# EAGLE design board (EAGLE 6.5.0)
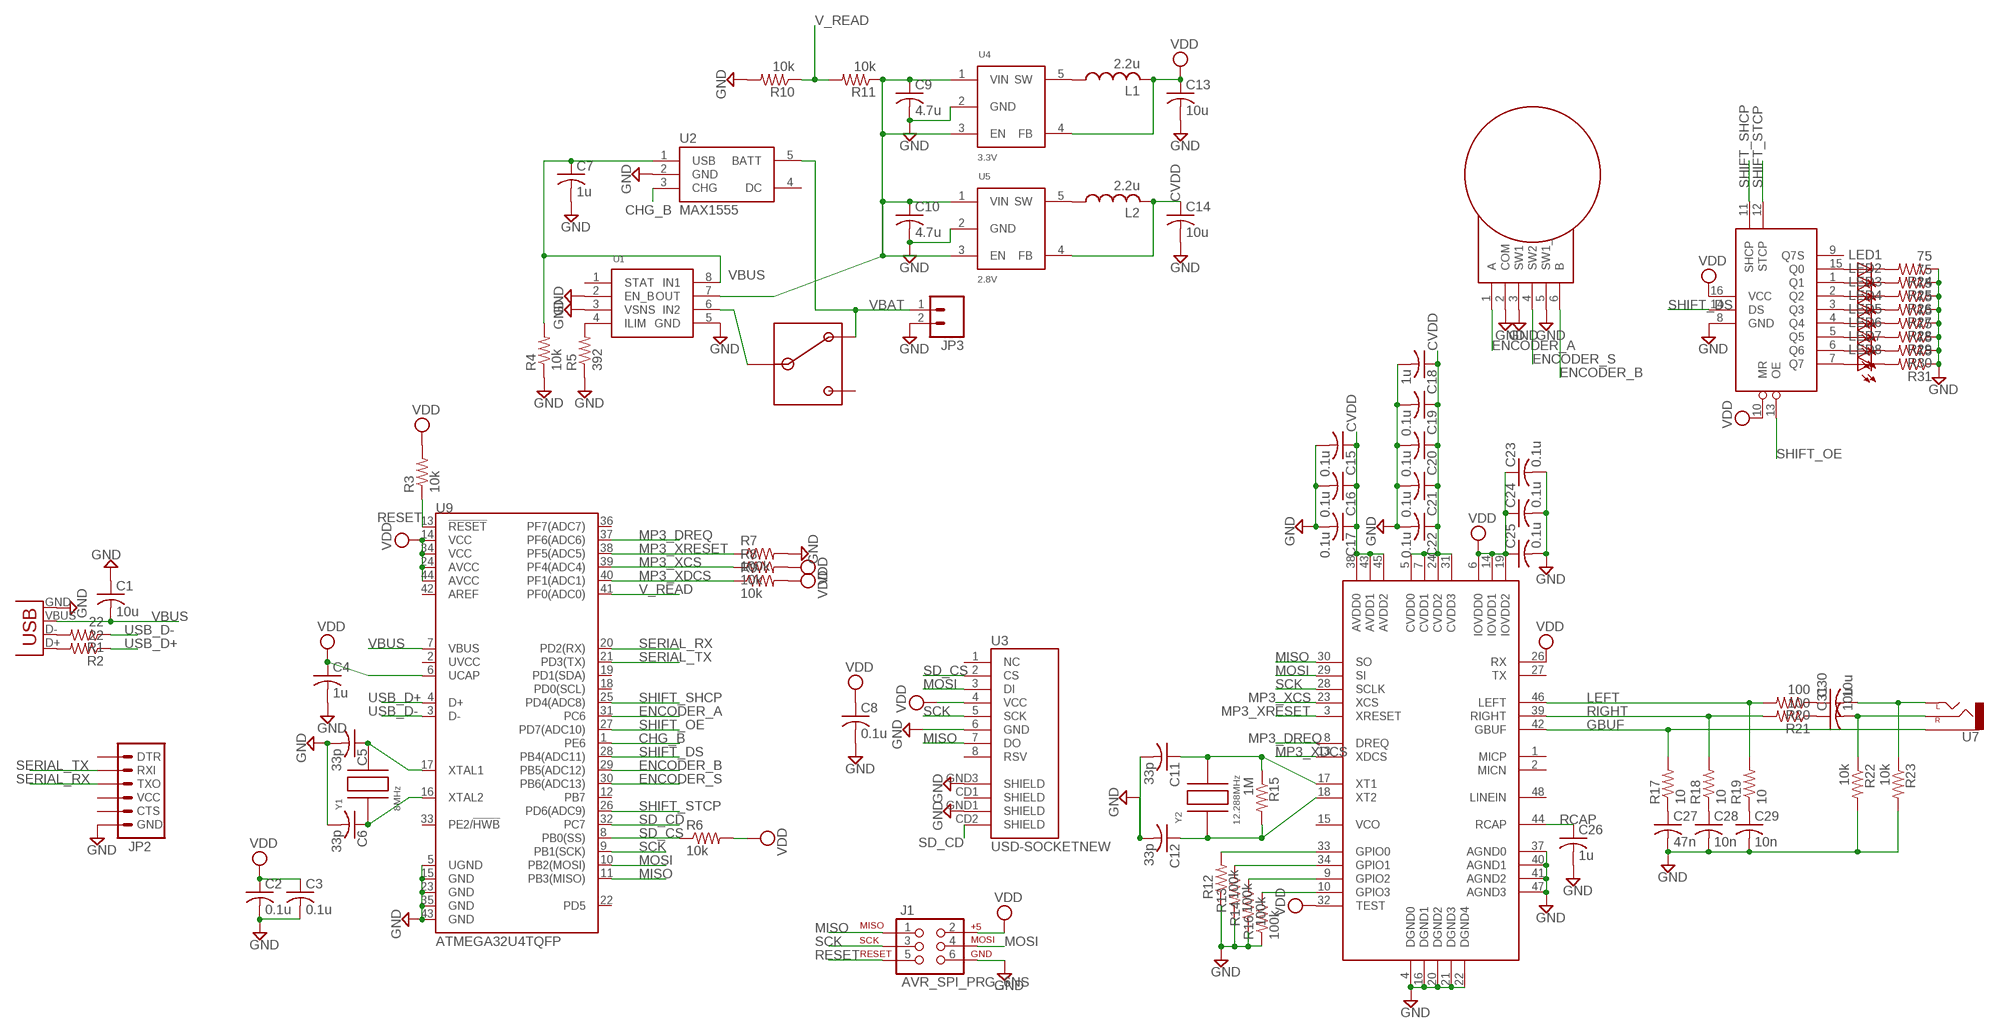
[diagram p0: schematic, sheet 1]

## Parts
C1  10u  C-USC0603K  [C0603K]
C2  0.1u  C-USC0603K  [C0603K]
C3  0.1u  C-USC0603K  [C0603K]
C4  1u  C-USC0603K  [C0603K]
C5  33p  C-USC0603K  [C0603K]
C6  33p  C-USC0603K  [C0603K]
C7  1u  C-USC0603K  [C0603K]
C8  0.1u  C-USC0603K  [C0603K]
C9  4.7u  C-USC0603K  [C0603K]
C10  4.7u  C-USC0603K  [C0603K]
C11  33p  C-USC0603K  [C0603K]
C12  33p  C-USC0603K  [C0603K]
C13  10u  C-USC0603K  [C0603K]
C14  10u  C-USC0603K  [C0603K]
C15  0.1u  C-USC0603K  [C0603K]
C16  0.1u  C-USC0603K  [C0603K]
C17  0.1u  C-USC0603K  [C0603K]
C18  1u  C-USC0603K  [C0603K]
C19  0.1u  C-USC0603K  [C0603K]
C20  0.1u  C-USC0603K  [C0603K]
C21  0.1u  C-USC0603K  [C0603K]
C22  0.1u  C-USC0603K  [C0603K]
C23  0.1u  C-USC0603K  [C0603K]
C24  0.1u  C-USC0603K  [C0603K]
C25  0.1u  C-USC0603K  [C0603K]
C26  1u  C-USC0603K  [C0603K]
C27  47n  C-USC0603K  [C0603K]
C28  10n  C-USC0603K  [C0603K]
C29  10n  C-USC0603K  [C0603K]
C30  10u  C-USC0603K  [C0603K]
C31  10u  C-USC0603K  [C0603K]
J1  AVR_SPI_PRG_6NS  [2X3-NS]
JP1  USBSMD  [USB-MINIB]
JP2  ARDUINO_SERIAL_PROGRAMLOCK  [1X06_LOCK]
JP3  M02PTH  [1X02]
L1  2.2u  IHLP-2020CZ-11  [IHLP-2020CZ-11]
L2  2.2u  IHLP-2020CZ-11  [IHLP-2020CZ-11]
LED1  LED1206  [LED-1206]
LED2  LED1206  [LED-1206]
LED3  LED1206  [LED-1206]
LED4  LED1206  [LED-1206]
LED5  LED1206  [LED-1206]
LED6  LED1206  [LED-1206]
LED7  LED1206  [LED-1206]
LED8  LED1206  [LED-1206]
R1  22  R-US_R0603W  [R0603W]
R2  22  R-US_R0603W  [R0603W]
R3  10k  R-US_R0603  [R0603]
R4  10k  R-US_R0603  [R0603]
R5  392  R-US_R0603  [R0603]
R6  10k  R-US_R0603W  [R0603W]
R7  100k  R-US_R0603W  [R0603W]
R8  10k  R-US_R0603W  [R0603W]
R9  10k  R-US_R0603W  [R0603W]
R10  10k  R-US_R0603  [R0603]
R11  10k  R-US_R0603  [R0603]
R12  100k  R-US_R0603W  [R0603W]
R13  100k  R-US_R0603W  [R0603W]
R14  100k  R-US_R0603W  [R0603W]
R15  1M  R-US_R0603  [R0603]
R16  100k  R-US_R0603W  [R0603W]
R17  10  R-US_R0603W  [R0603W]
R18  10  R-US_R0603W  [R0603W]
R19  10  R-US_R0603W  [R0603W]
R20  100  R-US_R0603W  [R0603W]
R21  100  R-US_R0603W  [R0603W]
R22  10k  R-US_R0603W  [R0603W]
R23  10k  R-US_R0603W  [R0603W]
R24  75  R-US_R0603W  [R0603W]
R25  75  R-US_R0603W  [R0603W]
R26  75  R-US_R0603W  [R0603W]
R27  75  R-US_R0603W  [R0603W]
R28  75  R-US_R0603W  [R0603W]
R29  75  R-US_R0603W  [R0603W]
R30  75  R-US_R0603W  [R0603W]
R31  75  R-US_R0603W  [R0603W]
S1  JS102011SAQN  [JS102011SAQN]
S2  EVQ-WKA  [EVQ-WKA]
U1  TPS2112A  [TSSOP8]
U2  MAX1555  [SOT23-5]
U3  USD-SOCKETNEW  [MICRO-SD-SOCKET-PP]
U4  3.3V  LM3671  [SOT23-5]
U5  2.8V  LM3671  [SOT23-5]
U6  74HC595  [TSSOP16]
U7  AUDIO-JACKSMD2  [AUDIO-JACK-3.5MM-SMD]
U8  VS1003  [LQFP-48]
U9  ATMEGA32U4TQFP  [SPARKFUN-DIGITALIC_TQFP44]
Y1  8MHz  CSM-7X  [HC49/US]
Y2  12.288MHz  CSM-3X  [CSM-3X]

## Nets
CHG_B: U2.3(CHG) U9.1(PE6)
CVDD: C14.1 C15.1 C16.1 C17.1 C18.1 C19.1 C20.1 C21.1 C22.1 L2.P$2 U5.4(FB) U8.5(CVDD0) U8.7(CVDD1) U8.24(CVDD2) U8.31(CVDD3) U8.38(AVDD0) U8.43(AVDD1) U8.45(AVDD2)
ENCODER_A: S2.1(A) U9.31(PC6)
ENCODER_B: S2.6(B) U9.29(PB5(ADC12))
ENCODER_S: S2.4(SW2) U9.30(PB6(ADC13))
GBUF: R17.2 U7.SLEEVE U8.42(GBUF)
GND: C1.1 C2.2 C3.2 C4.2 C5.2 C6.2 C7.2 C8.2 C9.2 C10.2 C11.2 C12.2 C13.2 C14.2 C15.2 C16.2 C17.2 C18.2 C19.2 C20.2 C21.2 C22.2 C23.2 C24.2 C25.2 C26.2 C27.2 C28.2 C29.2 J1.6 JP1.GND JP2.6(GND) JP3.2 R4.1 R5.1 R7.2 R10.2 R12.1 R13.1 R14.1 R16.1 R22.2 R23.2 R24.1 R25.1 R26.1 R27.1 R28.1 R29.1 R30.1 R31.1 S2.2(COM) S2.3(SW1) S2.5(SW1_) U1.2(EN_B) U1.3(VSNS) U1.5(GND) U2.2(GND) U3.6(GND) U3.GND1(SHIELD) U3.GND3(SHIELD) U4.2(GND) U5.2(GND) U6.8(GND) U8.4(DGND0) U8.16(DGND1) U8.20(DGND2) U8.21(DGND3) U8.22(DGND4) U8.37(AGND0) U8.40(AGND1) U8.41(AGND2) U8.47(AGND3) U9.5(UGND) U9.15(GND) U9.23(GND) U9.35(GND) U9.43(GND)
GPIO0: R12.2 U8.33(GPIO0)
GPIO1: R13.2 U8.34(GPIO1)
GPIO2: R14.2 U8.9(GPIO2)
GPIO3: R16.2 U8.10(GPIO3)
LEFT: R19.2 R20.2 U8.46(LEFT)
MISO: J1.1 U3.7(DO) U8.30(SO) U9.11(PB3(MISO))
MOSI: J1.4 U3.3(DI) U8.29(SI) U9.10(PB2(MOSI))
MP3_DREQ: U8.8(DREQ) U9.37(PF6(ADC6))
MP3_XCS: R8.1 U8.23(XCS) U9.39(PF4(ADC4))
MP3_XDCS: R9.1 U8.13(XDCS) U9.40(PF1(ADC1))
MP3_XRESET: R7.1 U8.3(XRESET) U9.38(PF5(ADC5))
N$1: JP1.D- R1.2
N$2: C5.1 U9.17(XTAL1) Y1.P$2
N$3: C27.1 R17.1
N$4: C28.1 R18.1
N$5: C29.1 R19.1
N$6: JP1.D+ R2.2
N$7: C12.1 R15.2 U8.18(XT2) Y2.P$1
N$8: C11.1 R15.1 U8.17(XT1) Y2.P$2
N$10: C31.1 R21.1
N$11: C30.1 R20.1
N$12: C31.2 R22.1 U7.RING(RIGHT)
N$13: C30.2 R23.1 U7.TIP(LEFT)
N$14: C6.1 U9.16(XTAL2) Y1.P$1
N$17: R5.2 U1.4(ILIM)
N$18: C9.1 C10.1 R11.1 U1.7(OUT) U4.1(VIN) U4.3(EN) U5.1(VIN) U5.3(EN)
N$19: LED8.A U6.7(Q7)
N$20: LED7.A U6.6(Q6)
N$21: LED6.A U6.5(Q5)
N$22: LED5.A U6.4(Q4)
N$23: LED4.A U6.3(Q3)
N$24: LED3.A U6.2(Q2)
N$25: LED2.A U6.1(Q1)
N$26: LED1.A U6.15(Q0)
N$27: LED1.C R24.2
N$28: LED2.C R25.2
N$29: LED3.C R26.2
N$30: LED4.C R27.2
N$31: LED5.C R28.2
N$32: LED6.C R29.2
N$33: LED7.C R30.2
N$34: LED8.C R31.2
N$35: L1.P$1 U4.5(SW)
N$36: L2.P$1 U5.5(SW)
N$37: S1.P$2 U1.6(IN2)
RCAP: C26.1 U8.44(RCAP)
RESET: J1.5 R3.1 U9.13(!RESET)
RIGHT: R18.2 R21.2 U8.39(RIGHT)
SCK: J1.3 U3.5(SCK) U8.28(SCLK) U9.9(PB1(SCK))
SD_CD: U3.CD2(SHIELD) U9.32(PC7)
SD_CS: R6.1 U3.2(CS) U9.8(PB0(SS))
SERIAL_RX: JP2.3(TXO) U9.20(PD2(RX))
SERIAL_TX: JP2.2(RXI) U9.21(PD3(TX))
SHIFT_DS: U6.14(DS) U9.28(PB4(ADC11))
SHIFT_OE: U6.13(OE) U9.27(PD7(ADC10))
SHIFT_SHCP: U6.11(SHCP) U9.25(PD4(ADC8))
SHIFT_STCP: U6.12(STCP) U9.26(PD6(ADC9))
USB_D+: R2.1 U9.4(D+)
USB_D-: R1.1 U9.3(D-)
V_READ: R10.1 R11.2 U9.41(PF0(ADC0))
VBAT: JP3.1 S1.P$3 U2.5(BATT)
VBUS: C1.2 C7.1 JP1.VBUS R4.2 U1.8(IN1) U2.1(USB) U9.7(VBUS)
VDD: C2.1 C3.1 C4.1 C8.1 C13.1 C23.1 C24.1 C25.1 J1.2 L1.P$2 R3.2 R6.2 R8.2 R9.2 U3.4(VCC) U4.4(FB) U6.10(MR) U6.16(VCC) U8.6(IOVDD0) U8.14(IOVDD1) U8.19(IOVDD2) U8.26(RX) U8.32(TEST) U9.6(UCAP) U9.14(VCC) U9.24(AVCC) U9.34(VCC) U9.44(AVCC)
Unconnected: JP2.1(DTR) JP2.4(VCC) JP2.5(CTS) S1.P$1 U1.1(STAT) U2.4(DC) U3.1(NC) U3.8(RSV) U3.CD1(SHIELD) U6.9(Q7S) U8.1(MICP) U8.2(MICN) U8.15(VCO) U8.27(TX) U8.48(LINEIN) U9.2(UVCC) U9.12(PB7) U9.18(PD0(SCL)) U9.19(PD1(SDA)) U9.22(PD5) U9.33(PE2/!HWB) U9.36(PF7(ADC7)) U9.42(AREF)

## Library data of the parts
C1-C31 = rcl:C-US: CAPACITOR, American symbol
J1 = SparkFun-Connectors:AVR_SPI_PRG_6: AVR ISP 6 Pin This is the reduced ISP connector for AVR programming. Common on Arduino. This footprint will take up less PCB space and can be used with a 10-pin to 6-pin adapter such as SKU: BOB-08508
JP1 = SparkFun-Connectors:USB: USB Connectors USB-B-PTH is fully proven SKU : PRT-00139/CONN-08278 USB-miniB is fully proven SKU : PRT-00587 USB-A-PCB is untested. USB-A-H is throughly reviewed, but untested. Spark Fun Electronics SKU : PRT-00437 USB-B-SMT is throughly reviewed, but untested. Needs silkscreen touching up. USB-A-S has not been used/tested USB-MB-H has not been used/tested USB-MICROB has been used. CONN-09505
JP2 = SparkFun-Connectors:ARDUINO_SERIAL_PROGRAM: FTDI connector footprints
JP3 = SparkFun-Connectors:M02: Header 2 Standard 2-pin 0.1" header. Use with straight break away headers (SKU : PRT-00116), right angle break away headers (PRT-00553), swiss pins (PRT-00743), machine pins (PRT-00117), and female headers (PRT-00115). Molex polarized connector foot print use with SKU : PRT-08233 with associated crimp pins and housings.
L1 L2 = mkmp3:IHLP-2020CZ-11: IHLP-2020CZ-11 - SMT Inductor Digikey: 541-1236-1-ND
LED1-LED8 = LilyPad-Wearables:LED: LEDs Standard schematic elements and footprints for 5mm, 3mm, 1206, and 0603 sized LEDs. 5mm - Spark Fun Electronics SKU : Comp-SBL
R1-R31 = rcl:R-US_: RESISTOR, American symbol
S1 = mkmp3:JS102011SAQN: JS102011SAQN - SMT slide switch Digikey: 401-1999-1-ND
S2 = mkmp3:EVQ-WKA: EVQ-WKA - Rotary encoder & switch Digikey: P13381SCT-ND
U1 = mkmp3:TPS2112A: TPS2112A - Source selector switch Digikey: 296-34595-5-ND
U2 = SparkFun-PowerIC:MAX1555: MAX1555 Lithium Charger IC SOT-23 Lithium Polymer charging IC. Schematic element and footprint proven. Spark Fun Electronics SKU : COM-00674
U3 = SparkFun-Connectors:USD-SOCKET: microSD Socket Push-push type uSD socket. Schematic element and footprint production proven. Spark Fun Electronics SKU : PRT-00127. tDoc lines correctly indicate media card edge positions when inserting (unlocked, locked, depressed).
U4 U5 = mkmp3:LM3671: LM3671 - Buck regulator Texas Instruments Step-down (buck) power regulator
U6 = mkmp3:74HC595: 74HC595 - 8-bit shift register Digikey: 568-2263-1-ND
U7 = mkmp3:AUDIO-JACK: 3.5mm Audio Jack Simple 3.5mm common PCB mount audio jack. SKU: PRT-08032
U8 = mkmp3:VS1003
U9 = SparkFun-DigitalIC:ATMEGA32U4: Atmel 44-pin 8-bit Microcontroller with 32KBytes of ISP Flash and USB Controller ----- Please use the QFN-44-NOPAD_1:1 package for the footprint of all boards using a 32U4. Route traces directly away from the pads as much as possible.
Y1 = mkmp3:CSM-7X: CSM-7X - Quartz Crystal ECS International SMD version of the HC-49USX leaded crystal
Y2 = mkmp3:CSM-3X: CMS-3X - Quartz Crystal ECS International Miniature low profile SMD quartz crystal

## Board
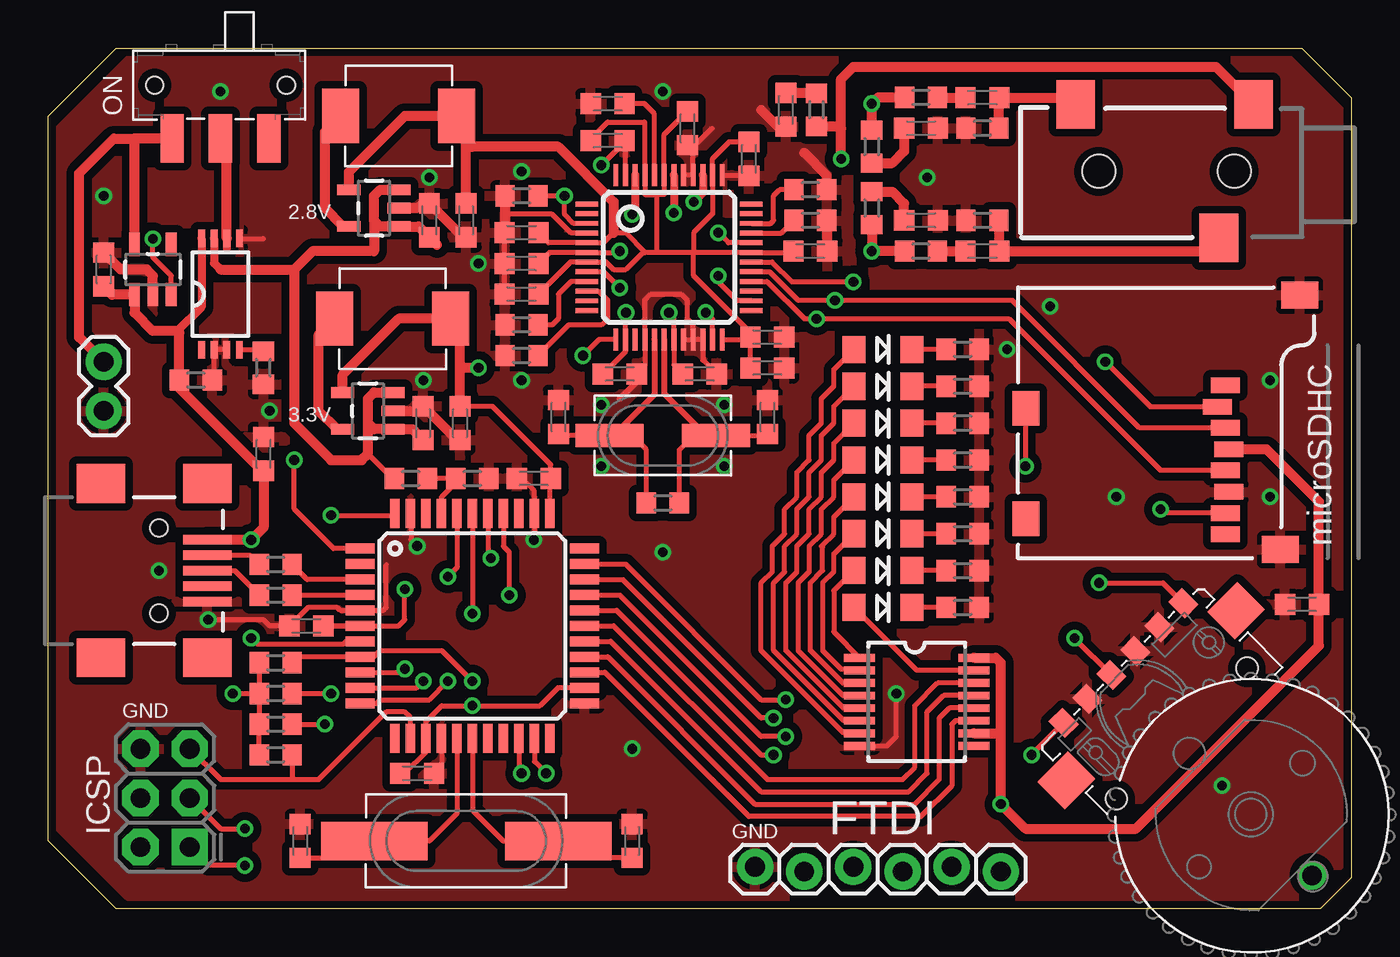
[diagram p1: board, top side]
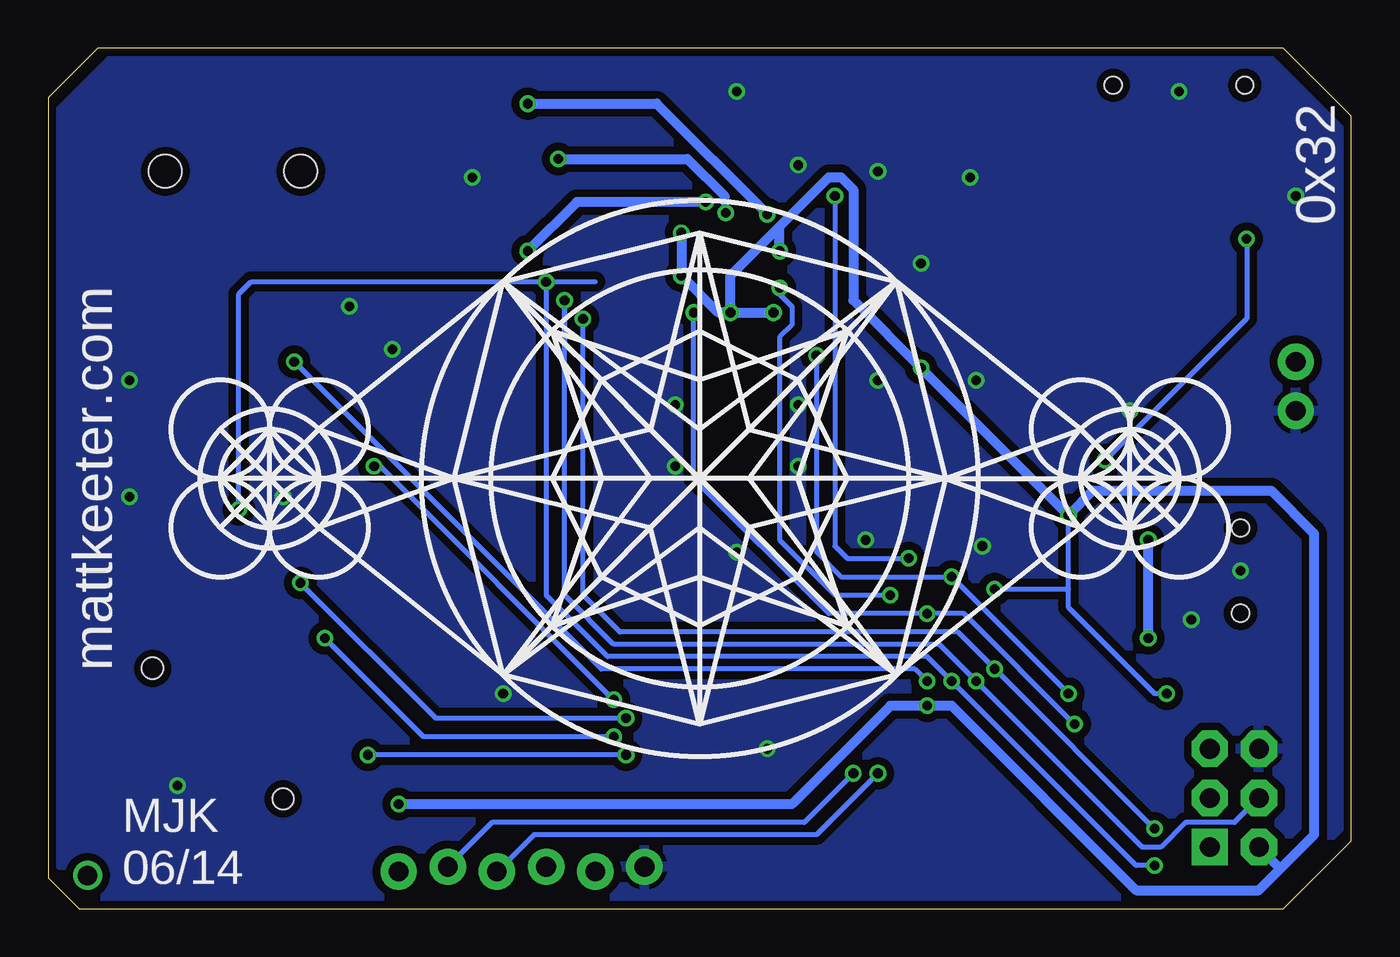
[diagram p2: board, bottom side, seen from below]

Size 67.31 x 44.45 mm. Coordinates in mm from the lower left corner, seen from the top.
Outline: 0,3.49 0,40.96 3.49,44.45 64.77,44.45 67.31,41.91 67.31,1.59 65.72,0 3.49,0 0,3.49
Copper layers (1*16): Top 0.0356mm / dielectric 1.5011mm / Bottom 0.0356mm
Design rules "OSHpark *": minimum track width 6mil, minimum drill 13mil, track to track 6mil, track to pad 6mil, pad to pad 6mil, via to via 6mil, smd to smd 6mil, copper to edge 15mil, drill to drill 6mil, minimum pad ring 7mil, minimum via ring 7mil, stop-mask expansion 4mil, vias tented up to drill 20mil, thermal gap 10mil

### Footprints (pad centres in the part's own frame; a part is rotated, then mirrored left to right if it is on the bottom)
C0603K = smd 1.05 x 1.08: 1 -0.875,0; 2 0.875,0
2X3-NS = drill 1.016 pad 1.88 square: 1 -2.54,-1.27 | drill 1.016 pad 1.88 octagon: 2 -2.54,1.27; 3 0,-1.27; 4 0,1.27; 5 2.54,-1.27; 6 2.54,1.27
USB-MINIB = smd 2.5 x 0.5: D+ 2.5,0; D- 2.5,0.8; GND 2.5,-1.6; ID 2.5,-0.8; VBUS 2.5,1.6 | smd 2.5 x 2: MTN1 -3,4.5; MTN2 2.5,4.5; MTN3 -3,-4.5; MTN4 2.5,-4.5 | hole 0.9: 0,2.2; 0,-2.2
1X06_LOCK = drill 1.016 pad 1.88: 1 0,0; 2 2.54,-0.254; 3 5.08,0; 4 7.62,-0.254; 5 10.16,0; 6 12.7,-0.254
1X02 = drill 1.016 pad 1.88: 1 0,0; 2 2.54,0
IHLP-2020CZ-11 = smd 1.905 x 2.794: P$1 -2.997,0; P$2 2.997,0
LED-1206 = smd 1.2 x 1.4: A -1.5,0; C 1.5,0
R0603W = smd 1 x 1.1: 1 -0.85,0; 2 0.85,0
R0603 = smd 1 x 1.1: 1 -0.85,0; 2 0.85,0
JS102011SAQN = smd 1.2 x 2.5: P$1 -2.5,2.75; P$2 0,2.75; P$3 2.5,2.75 | hole 0.9: -3.4,0; 3.4,0
EVQ-WKA = smd 1 x 1.2: 1 -5.25,0; 2 -3.5,0; 3 -1.75,0; 4 0,0; 5 1.75,0; 6 3.5,0 | smd 2.2 x 2: NC1 -6.9,2.2; NC2 5.5,2.2 | drill 1: P$1 0,14.65 | hole 1.1: 4.35,4.7; -5.2,4.7
TSSOP8 = smd 0.9 x 0.35: 1 -2.875,0.975; 2 -2.875,0.325; 3 -2.875,-0.325; 4 -2.875,-0.975; 5 2.875,-0.975; 6 2.875,-0.325; 7 2.875,0.325; 8 2.875,0.975
SOT23-5 = smd 0.55 x 1.2: 1 -0.95,-1.3; 2 0,-1.3; 3 0.95,-1.3; 4 0.95,1.3; 5 -0.95,1.3
MICRO-SD-SOCKET-PP = smd 0.8 x 1.5: 1 -8.94,10.7; 2 -7.84,10.3; 3 -6.74,10.7; 4 -5.64,10.9; 5 -4.54,10.7; 6 -3.44,10.9; 7 -2.34,10.7; 8 -1.24,10.7 | smd 1.8 x 1.4: CD1 -2.05,0.4; CD2 -7.75,0.4 | smd 1.4 x 1.9: GND1 -13.6,14.55; GND3 -0.45,13.55
TSSOP16 = smd 0.4 x 1.6: 1 -2.225,-2.85; 2 -1.575,-2.85; 3 -0.925,-2.85; 4 -0.275,-2.85; 5 0.375,-2.85; 6 1.025,-2.85; 7 1.675,-2.85; 8 2.325,-2.85; 9 2.325,3.05; 10 1.675,3.05; 11 1.025,3.05; 12 0.375,3.05; 13 -0.275,3.05; 14 -0.925,3.05; 15 -1.575,3.05; 16 -2.225,3.05
AUDIO-JACK-3.5MM-SMD = smd 2 x 2.5: RING 4.3,3.45; SLEEVE 2.5,-3.45; TIP 11.7,-3.45 | hole 1.702: 3.5,0; 10.5,0
LQFP-48 = smd 0.254 x 1.143: 1 -2.75,-4.25; 2 -2.25,-4.25; 3 -1.75,-4.25; 4 -1.25,-4.25; 5 -0.75,-4.25; 6 -0.25,-4.25; 7 0.25,-4.25; 8 0.75,-4.25; 9 1.25,-4.25; 10 1.75,-4.25; 11 2.25,-4.25; 12 2.75,-4.25; 25 2.75,4.25; 26 2.25,4.25; 27 1.75,4.25; 28 1.25,4.25; 29 0.75,4.25; 30 0.25,4.25; 31 -0.25,4.25; 32 -0.75,4.25; 33 -1.25,4.25; 34 -1.75,4.25; 35 -2.25,4.25; 36 -2.75,4.25 | smd 1.143 x 0.254: 13 4.25,-2.75; 14 4.25,-2.25; 15 4.25,-1.75; 16 4.25,-1.25; 17 4.25,-0.75; 18 4.25,-0.25; 19 4.25,0.25; 20 4.25,0.75; 21 4.25,1.25; 22 4.25,1.75; 23 4.25,2.25; 24 4.25,2.75; 37 -4.25,2.75; 38 -4.25,2.25; 39 -4.25,1.75; 40 -4.25,1.25; 41 -4.25,0.75; 42 -4.25,0.25; 43 -4.25,-0.25; 44 -4.25,-0.75; 45 -4.25,-1.25; 46 -4.25,-1.75; 47 -4.25,-2.25; 48 -4.25,-2.75
SPARKFUN-DIGITALIC_TQFP44 = smd 1.5 x 0.5: 1 -5.8,4; 2 -5.8,3.2; 3 -5.8,2.4; 4 -5.8,1.6; 5 -5.8,0.8; 6 -5.8,0; 7 -5.8,-0.8; 8 -5.8,-1.6; 9 -5.8,-2.4; 10 -5.8,-3.2; 11 -5.8,-4; 23 5.8,-4; 24 5.8,-3.2; 25 5.8,-2.4; 26 5.8,-1.6; 27 5.8,-0.8; 28 5.8,0; 29 5.8,0.8; 30 5.8,1.6; 31 5.8,2.4; 32 5.8,3.2; 33 5.8,4 | smd 0.5 x 1.5: 12 -4,-5.8; 13 -3.2,-5.8; 14 -2.4,-5.8; 15 -1.6,-5.8; 16 -0.8,-5.8; 17 0,-5.8; 18 0.8,-5.8; 19 1.6,-5.8; 20 2.4,-5.8; 21 3.2,-5.8; 22 4,-5.8; 34 4,5.8; 35 3.2,5.8; 36 2.4,5.8; 37 1.6,5.8; 38 0.8,5.8; 39 0,5.8; 40 -0.8,5.8; 41 -1.6,5.8; 42 -2.4,5.8; 43 -3.2,5.8; 44 -4,5.8
HC49/US = smd 5.5 x 2: P$1 -4.75,0; P$2 4.75,0
CSM-3X = smd 3.5 x 1.2: P$1 -2.75,0; P$2 2.75,0

### Placement (x,y rotation side)
C1  11.11,23.5 270 top
C2  25.08,22.23 180 top
C3  19.05,6.98 0 top
C4  13.33,14.61 180 top
C5  30.16,3.49 90 top
C6  13.02,3.49 90 top
C7  2.86,33.02 90 top
C8  64.77,15.72 180 top
C9  19.37,25.08 90 top
C10  19.69,35.56 90 top
C11  26.35,25.4 90 top
C12  37.15,25.4 90 top
C13  21.27,25.08 270 top
C14  21.59,35.56 270 top
C15  36.2,38.73 270 top
C16  33.02,40.32 270 top
C17  24.45,31.75 180 top
C18  37.15,27.94 0 top
C19  39.37,33.97 0 top
C20  24.45,34.92 180 top
C21  37.15,29.53 0 top
C22  28.89,39.69 0 top
C23  24.45,33.34 180 top
C24  29.53,27.62 0 top
C25  33.66,27.62 0 top
C26  28.89,41.59 180 top
C27  38.1,41.27 270 top
C28  45.09,35.56 0 top
C29  45.09,40.32 0 top
C30  48.26,41.91 0 top
C31  48.26,33.97 0 top
J1  6.03,5.71 90 top
JP1  5.71,17.46 0 top
JP2  49.21,1.91 180 top
JP3  2.86,28.26 270 top
L1  17.78,30.48 0 top
L2  18.1,40.96 0 top
LED1  43.12,15.56 0 top
LED2  43.12,17.46 0 top
LED3  43.12,19.37 0 top
LED4  43.12,21.27 0 top
LED5  43.12,23.18 0 top
LED6  43.12,25.08 0 top
LED7  43.12,26.99 0 top
LED8  43.12,28.89 0 top
R1  11.75,17.78 180 top
R2  11.75,16.19 180 top
R3  11.75,7.94 180 top
R4  7.62,27.31 180 top
R5  11.11,27.94 90 top
R6  11.75,12.7 180 top
R7  24.45,36.83 180 top
R8  11.75,9.53 180 top
R9  11.75,11.11 180 top
R10  21.91,22.23 0 top
R11  18.73,22.23 0 top
R12  39.37,35.56 180 top
R13  39.37,37.15 180 top
R14  24.45,30.16 0 top
R15  31.75,20.96 0 top
R16  24.45,28.58 0 top
R17  39.69,41.27 270 top
R18  42.54,36.2 270 top
R19  42.54,39.37 90 top
R20  45.09,41.91 180 top
R21  45.09,33.97 180 top
R22  48.26,35.56 180 top
R23  48.26,40.32 180 top
R24  47.24,15.56 180 top
R25  47.24,17.46 180 top
R26  47.24,19.37 180 top
R27  47.24,21.27 180 top
R28  47.24,23.18 180 top
R29  47.24,25.08 180 top
R30  47.24,26.99 180 top
R31  47.24,28.89 180 top
S1  8.89,42.54 180 top
S2  54.93,12.06 225 top
U1  8.89,31.75 90 top
U2  5.4,33.02 0 top
U3  50.1,18.1 270 top
U4  16.51,25.72 90 top
U5  16.83,36.2 90 top
U6  44.77,10.73 270 top
U7  64.77,38.1 180 top
U8  32.07,33.66 270 top
U9  21.91,14.61 0 top
Y1  21.59,3.49 0 top
Y2  31.75,24.45 180 top

### Tracks (layer width: path | path; a pad name or v marks a point on that pad's centre or on a via)
CHG_B  (via drill 0.5)
  Top 0.254: v5.4,34.61 5.4,33.66 6.35,32.7 U2.3 | U9.1 14.73,18.61 12.7,20.64 v12.7,23.18
  Bottom 0.254: v5.4,34.61 5.4,30.48 v12.7,23.18
CVDD
  Top 0.254: C15.1 35.16,39.61 34.32,38.76 U8.38 34.32,35.91 33.34,34.92 33.34,33.91 | U8.24 36.15,29.41 C21.1 | C20.1 25.84,34.41 U8.5 28.69,34.41 29.21,34.92 29.85,34.92 30.87,33.91 | C18.1 C21.1 | C19.1 38.43,33.91 U8.31 33.34,33.91 | 33.34,33.91 33.34,32.7 36.27,29.77 C21.1 | C17.1 26.98,33.41 U8.7 28.83,33.41 29.21,33.02 29.85,33.02 30.73,33.91 30.87,33.91 | C22.1 28.02,40.08 | C16.1 31.82,39.99 U8.43 31.82,36.9 31.43,36.9 | C22.1 28.02,39.77 28.89,40.64 30.8,40.64 30.82,40.62 U8.45 30.82,36.9 31.43,36.9 | 33.34,33.91 31.43,33.91 | 31.43,33.91 30.87,33.91 | 27.7,39.37 C22.1 | 31.43,36.9 31.43,33.91
  Top 0.508: U5.4 15.53,38.07 18.42,40.96 L2.P$2 21.59,40.46 21.59,39.69 | 29.21,34.92 29.21,36.51 26.35,39.37 21.91,39.37 21.59,39.69 | C14.1 21.59,39.69
ENCODER_A  (via drill 0.5)
  Top 0.254: v54.29,16.83 57.59,16.83 S2.1 | v37.46,9.84 36.83,9.84 29.67,17.01 U9.31
  Bottom 0.254: v54.29,16.83 47.31,9.84 v37.46,9.84
ENCODER_B  (via drill 0.5)
  Top 0.254: U9.29 29.36,15.4 36.83,7.94 v37.46,7.94 | v50.8,7.94 S2.6
  Bottom 0.254: v37.46,7.94 v50.8,7.94
ENCODER_S  (via drill 0.5)
  Top 0.254: v53.02,13.97 S2.4 | v38.1,8.89 36.83,8.89 29.52,16.21 U9.30
  Bottom 0.254: v53.02,13.97 47.94,8.89 v38.1,8.89
GBUF  (via drill 0.5)
  Top 0.406: U8.42 v32.32,35.95
  Top 0.508: U7.SLEEVE 60.32,43.5 41.59,43.5 40.96,42.86 40.96,40.32 | v40.96,38.73 40.96,40.32 | R17.2 40.85,40.42 40.96,40.32
  Bottom 0.406: v32.32,35.95 32.32,36.76 32.38,36.83
  Bottom 0.508: v40.96,38.73 34.29,38.73 32.38,36.83
GND  (via drill 0.5)
  Top 0.254: R4.1 8.56,27.4 U1.2 U1.3 | C17.2 C23.2 C20.2 | U8.21 U8.22 33.82,28.34 C25.2 | U8.37 36.15,37.91 C15.2 | 34.29,40.32 33.32,39.35 33.32,39.15 | U1.5 11.1,34.62 11.11,34.61 | 23.6,35.88 26.04,35.88 27.01,34.91 U8.4 | U6.8 43.33,8.41 43.81,8.89 v43.81,11.11 | U9.43 18.73,20.38 18.73,19.05 v19.05,18.73 | v8.26,14.92 11.11,14.92 11.43,14.61 C4.2 13.41,15.56 14.92,15.56 15.07,15.4 U9.5 17.31,15.4 17.46,15.56 17.46,17.78 | v25.08,19.05 25.11,19.08 U9.35 25.11,21.57 24.45,22.23 | U9.15 20.31,7.37 C3.2 | C24.2 30.82,28.04 U8.16 30.82,31.45 31.12,31.75 32.7,31.75 33.02,31.43 33.02,30.48 33.32,30.18 U8.21 | 33.32,39.15 U8.40 U8.41 | 33.32,39.15 C16.2 | 29.82,39.64 29.8,39.64 v28.58,38.42 | U8.47 29.82,39.64 | 29.82,39.64 C22.2 | U8.20 U8.21
  Top 0.305: C24.2 30.4,27.23 29.53,26.35
  Top 0.406: C10.2 19.29,36.43 19.05,36.2
  Top 0.508: 19.05,36.2 18.1,36.2 | U4.2 19.13,25.72 C9.2 21.12,24.21 C13.2 | 19.69,36.27 C10.2 21.44,34.68 C14.2 | U2.2 5.4,32.7 5.08,33.02 3.73,33.02 C7.2 | R12.1 40.22,34 C19.2 | R13.1 40.22,37.88 39.05,39.05 | 38.1,40.32 37.78,40.32 36.83,41.27 | R7.2 23.6,35.88 23.6,34.95 C20.2
  other vias: 45.4,37.78 11.43,25.72 19.37,27.31 19.69,37.78 63.12,21.27 2.86,36.83 31.75,42.23 63.12,27.31 5.71,17.46 8.89,42.23 28.58,22.86 34.92,22.86 55.18,21.27 22.23,33.34 24.45,38.1 30.16,8.26 31.75,18.42 24.45,27.31 34.92,26.04 51.75,31.12 49.53,28.89 60.64,6.35 28.58,26.04
  pour Bottom (isolate 0.406): 4.13,0.64 0.64,4.13 0.64,40.32 4.13,43.81 64.14,43.81 66.68,41.27 66.68,2.22 65.09,0.64
  pour Top (isolate 0.406): 4.13,0.64 0.64,4.13 0.64,40.32 4.13,43.81 64.14,43.81 66.68,41.27 66.68,2.22 65.09,0.64
GPIO0
  Top 0.254: U8.33 37.86,34.91 R12.2
GPIO1
  Top 0.254: U8.34 37.31,35.41 37.46,35.56 37.46,36.83 37.78,37.15 R13.2
GPIO2
  Top 0.254: U8.9 27.01,32.41 26.35,31.75 26.35,30.48 26.04,30.16 R14.2
GPIO3
  Top 0.254: U8.10 28.42,31.91 28.89,31.43 28.89,30.48 28.58,30.16 26.89,30.16 R16.2
LEFT  (via drill 0.5)
  Top 0.406: U8.46 30.32,36.03 v30.16,35.88
  Top 0.508: R19.2 v42.54,41.59 42.86,41.91 R20.2
  Bottom 0.508: v30.16,35.88 35.88,41.59 v42.54,41.59
MISO  (via drill 0.5)
  Top 0.254: U8.30 37.4,33.41 38.42,32.38 v41.59,32.38 | 15.69,10.61 U9.11 16.96,10.61 17.15,10.79 19.69,10.79 v20.64,11.75 | U3.7 57.67,20.44 v57.47,20.64 | v10.16,2.22 8.26,2.22 J1.1
  Bottom 0.254: v57.47,20.64 57.47,31.75 56.83,32.38 v41.59,32.38 | v41.59,32.38 39.05,32.38 | v10.16,2.22 11.11,2.22 v20.64,11.75 21.91,13.02 38.42,13.02 41.59,16.19 v41.59,32.38
MOSI  (via drill 0.5)
  Top 0.254: U3.3 56.38,24.84 49.78,31.43 v40.64,31.43 38.73,31.43 37.26,32.91 U8.29 | U9.10 19.03,11.4 v19.37,11.75
  Bottom 0.254: 40.64,29.21 v40.64,31.43 40.64,16.19 38.1,13.65 21.27,13.65 v19.37,11.75 10.79,3.17 9.84,3.17 8.57,4.45 6.03,4.45 J1.4
MP3_DREQ  (via drill 0.5)
  Top 0.254: U8.8 28.69,32.91 v29.53,32.07 | U9.37 23.51,18.72 23.81,18.42 v23.81,16.19
  Bottom 0.254: v29.53,32.07 29.53,31.75 28.89,31.12 28.89,30.16 29.53,29.53 29.53,19.05 26.67,16.19 v23.81,16.19
MP3_XCS  (via drill 0.5)
  Top 0.254: U8.23 34.32,30.45 v33.97,30.8 | R8.1 v14.29,9.53 | U9.39 v21.91,15.24
  Bottom 0.254: v33.97,30.8 33.97,22.23 26.99,15.24 v21.91,15.24 20,15.24 v14.29,9.53
MP3_XDCS  (via drill 0.5)
  Top 0.254: U8.13 28.45,29.41 v27.62,28.58 | R9.1 v14.61,11.11 | U9.40 21.11,17.62 v20.64,17.15
  Bottom 0.254: v14.61,11.11 v20.64,17.15 26.35,17.15 27.62,18.42 v27.62,28.58
MP3_XRESET  (via drill 0.5)
  Top 0.254: U8.3 27.14,35.41 26.67,35.88 v26.67,36.83 R7.1 | U9.38 22.71,18.25 v22.86,18.1
  Bottom 0.254: v26.67,36.83 26.67,18.73 26.04,18.1 v22.86,18.1
N$1
  Top 0.254: JP1.D- 10.41,18.26 R1.2
N$2
  Top 0.254: U9.17 21.91,5.08 23.5,3.49 Y1.P$2 27.21,2.62 C5.1
N$3
  Top 0.508: R17.1 38.12,42.12 C27.1
N$4
  Top 0.508: C28.1 44.21,36.43 43.6,37.04 R18.1
N$5
  Top 0.508: C29.1 44.21,39.13 43.6,38.52 R19.1
N$6
  Top 0.254: JP1.D+ 9.63,17.46 R2.2
N$7
  Top 0.254: R15.2 32.6,23.71 33.66,24.77 | Y2.P$1 37.07,24.45 C12.1
  Top 0.305: U8.18 31.82,26.6 33.66,24.77 33.97,24.45 Y2.P$1
N$8
  Top 0.254: R15.1 30.9,23.71 29.69,24.92 | Y2.P$2 26.43,24.45 C11.1
  Top 0.305: U8.17 31.32,26.56 29.69,24.92 29.53,24.77 29.32,24.77 Y2.P$2
N$10
  Top 0.508: R21.1 C31.1
N$11
  Top 0.508: R20.1 C30.1
N$12
  Top 0.254: 49.13,35.59 R22.1
  Top 0.508: R22.1 49.11,34 C31.2 59.79,33.97 U7.RING
N$13
  Top 0.508: R23.1 49.11,41.88 C30.2 52.71,41.91 U7.TIP
N$14
  Top 0.254: U9.16 21.11,4.92 19.69,3.49 Y1.P$1 15.96,2.62 C6.1
N$17
  Top 0.254: U1.4 11.03,28.88 R5.2
N$18
  Top 0.254: R11.1 17.78,22.23 16.51,23.5
  Top 0.406: U5.3 | U4.3 | 8.89,33.02 8.56,33.34 U1.7
  Top 0.508: 16.83,35.56 17.14,35.24 U5.1 19.12,35.24 C10.1 20.08,34.29 | 16.83,35.56 16.83,36.83 17.15,37.15 U5.3 | C9.1 18.81,24.77 U4.1 16.83,24.77 16.51,25.08 | 16.51,25.08 16.51,26.35 16.83,26.67 U4.3 | 16.83,35.56 16.83,33.97 13.65,33.97 12.7,33.02 | 8.89,33.02 12.7,33.02 | 12.7,33.02 12.7,25.08 14.61,23.18 16.19,23.18 16.51,23.5 16.51,25.08
N$19
  Top 0.254: LED8.A 40.58,27.85 40.58,26.99 39.94,26.35 39.94,25.08 39.31,24.45 39.31,23.18 38.67,22.54 38.67,21.27 38.04,20.64 38.04,19.37 37.4,18.73 37.4,17.4 36.83,16.83 36.83,13.33 41.11,9.06 U6.7
N$20
  Top 0.254: LED7.A 40.58,25.95 40.58,25.08 39.94,24.45 39.94,23.18 39.31,22.54 39.31,21.27 38.67,20.64 38.67,19.37 38.04,18.73 38.04,17.4 37.46,16.83 37.46,13.33 41.09,9.71 U6.6
N$21
  Top 0.254: LED6.A 40.58,24.04 40.58,23.18 39.94,22.54 39.94,21.27 39.31,20.64 39.31,19.37 38.67,18.73 38.67,17.4 38.1,16.83 38.1,13.33 41.08,10.36 U6.5
N$22
  Top 0.254: LED5.A 40.58,22.14 40.58,21.27 39.94,20.64 39.94,19.37 39.31,18.73 39.31,17.4 38.73,16.83 38.73,13.33 41.06,11.01 U6.4
N$23
  Top 0.254: LED4.A 40.58,20.23 40.58,19.37 39.94,18.73 40,18.67 40,17.46 39.37,16.83 39.37,13.33 41.05,11.66 U6.3
N$24
  Top 0.254: LED3.A 40.58,18.33 40.58,17.4 40,16.83 40,13.33 40.96,12.38 41.84,12.38 U6.2
N$25
  Top 0.254: LED2.A 40.58,16.43 40.58,14.29 U6.1
N$26
  Top 0.254: U6.15 44.87,12.31 LED1.A
N$27
  Top 0.254: R24.2 LED1.C
N$28
  Top 0.254: R25.2 LED2.C
N$29
  Top 0.254: R26.2 LED3.C
N$30
  Top 0.254: R27.2 LED4.C
N$31
  Top 0.254: R28.2 LED5.C
N$32
  Top 0.254: R29.2 LED6.C
N$33
  Top 0.254: R30.2 LED7.C
N$34
  Top 0.254: R31.2 LED8.C
N$35
  Top 0.508: U4.5 14.92,24.77 13.97,25.72 13.97,29.67 L1.P$1
N$36
  Top 0.508: U5.5 15.24,35.24 14.29,36.2 14.29,40.14 L2.P$1
N$37
  Top 0.406: U1.6 9.21,34.12
  Top 0.508: U1.6 9.21,39.15 8.89,39.15 S1.P$2
RCAP
  Top 0.254: U8.44 31.32,41.07 30.8,41.59 C26.1
RESET
  Top 0.254: J1.5 8.89,6.67 12.7,6.67 | U9.13 18.71,9.87 18.42,10.16 17.46,10.16 13.97,6.67 12.7,6.67 | R3.1 12.6,6.77 12.7,6.67
RIGHT  (via drill 0.5)
  Top 0.406: U8.39 33.82,36.99 v33.34,36.51
  Top 0.508: R18.2 v42.54,33.97 R21.2
  Bottom 0.508: v33.34,36.51 40,36.51 v42.54,33.97
SCK  (via drill 0.5)
  Top 0.254: U3.5 57.47,22.64 49.62,30.48 v39.69,30.48 39.05,30.48 37.13,32.41 U8.28 | U9.9 18.24,12.21 v18.42,12.38 | J1.3 8.89,4.13 v10.16,4.13
  Bottom 0.254: v39.69,30.48 39.69,16.19 37.78,14.29 20.32,14.29 v18.42,12.38 v10.16,4.13
SD_CD  (via drill 0.5)
  Top 0.254: U9.32 29.82,17.81 36.83,10.79 v38.1,10.79 | U3.CD2 50.48,25.83 v50.48,22.86
  Bottom 0.254: v50.48,22.86 50.16,22.86 v38.1,10.79
SD_CS  (via drill 0.5)
  Top 0.254: R6.1 12.9,13 U9.8 16.82,13 17.15,13.33 20.32,13.33 v21.91,11.75 | v54.61,28.26 56.93,25.94 U3.2
  Bottom 0.254: v54.61,28.26 38.73,12.38 22.54,12.38 v21.91,11.75
SERIAL_RX  (via drill 0.5)
  Top 0.254: U9.20 24.31,7.12 v24.45,6.98
  Bottom 0.254: v24.45,6.98 27.62,3.81 42.23,3.81 JP2.3
SERIAL_TX  (via drill 0.5)
  Top 0.254: U9.21 25.11,7.59 v25.72,6.98
  Bottom 0.254: v25.72,6.98 28.26,4.45 44.39,4.45 JP2.2
SHIFT_DS
  Top 0.254: U9.28 29.21,14.61 37.15,6.67 44.13,6.67 44.77,7.3 44.77,10.48 45.95,11.66 U6.14
SHIFT_OE
  Top 0.254: U9.27 29.06,13.8 36.83,6.03 44.45,6.03 45.4,6.98 45.4,10.16 46.25,11.01 U6.13
SHIFT_SHCP
  Top 0.254: U6.11 46.85,9.71 46.67,9.53 46.67,6.35 45.09,4.76 36.2,4.76 28.75,12.21 U9.25
SHIFT_STCP
  Top 0.254: U9.26 28.91,13 36.51,5.4 44.77,5.4 46.04,6.67 46.04,9.84 46.55,10.36 U6.12
USB_D+
  Top 0.254: R2.1 16.1,16.19 U9.4
USB_D-
  Top 0.254: U9.3 13.37,17.01 R1.1
V_READ
  Top 0.254: R11.2 R10.1 21.06,22.01 20.31,21.26 U9.41
VBAT
  Top 0.508: JP3.1 1.59,29.53 1.59,38 3.38,39.79 4.45,39.79 | S1.P$3 4.45,39.79 | U2.5 4.45,39.79
VBUS  (via drill 0.5)
  Top 0.254: U9.7 15.39,13.8 15.24,13.65 10.79,13.65 v10.48,13.97
  Top 0.406: U1.8 7.92,31.09 6.67,29.85
  Top 0.508: C7.1 3.28,31.72 U2.1 4.45,30.8 5.4,29.85 6.67,29.85 6.77,29.74 R4.2 6.77,26.89 11.05,22.61 11.05,22.56 C1.2 11.11,19.69 v10.48,19.05 10.49,19.06 JP1.VBUS
  Bottom 0.508: v10.48,13.97 v10.48,19.05
VDD  (via drill 0.5)
  Top 0.254: C24.1 29.82,28.79 U8.14 29.82,30.77 v29.85,30.8 | U8.32 35.13,34.41 v34.61,34.92 | U8.26 35.59,31.41 34.61,32.38 v34.61,32.7 | v29.53,33.97 29.46,33.91 U8.6 25.89,33.91 C23.1 | C25.1 32.32,28.09 U8.19 32.32,30.55 v32.07,30.8 | v9.53,11.11 R9.2 | U9.34 25.91,22.18 C2.1 25.96,22.94 22.94,25.96 C13.1 | C3.1 18.42,6.98 19.51,8.08 U9.14 19.51,9.66 20.32,10.48 v21.91,10.48 25.4,10.48 26.33,11.4 U9.24 | R3.2 R8.2 R9.2 | R6.2 R9.2 | v14.61,20.32 17.82,20.32 U9.44 | U9.6 C4.1 18.1,14.61 18.42,14.92 v18.42,16.51
  Top 0.508: C13.1 21.27,27.94 | 21.27,27.94 21.27,29.99 L1.P$2 18.1,30.48 15.21,27.59 U4.4 | v22.23,27.94 21.27,27.94 | U3.4 62.94,23.74 65.65,21.03 C8.1 65.65,13.57 56.2,4.13 50.48,4.13 v49.21,5.4 49.21,8.89 | U6.16 48.96,12.96 49.21,12.7 49.21,8.89 | U6.10 49.05,9.06 49.21,8.89
  Bottom 0.254: v9.53,11.11 10.16,11.11 14.61,15.56 14.61,16.51 | 14.61,16.51 v14.61,20.32 | v18.42,16.51 14.61,16.51
  Bottom 0.508: v32.07,30.8 v29.85,30.8 | v34.61,34.92 v34.61,32.7 32.7,30.8 v32.07,30.8 | 3.65,2.06 4.76,0.95 11.11,0.95 20.64,10.48 v21.91,10.48 23.81,10.48 28.89,5.4 v49.21,5.4 | 3.65,2.06 1.91,3.81 1.91,19.37 4.13,21.59 13.33,21.59 v14.61,20.32 v22.23,27.94 25.72,31.43 25.72,37.15 26.35,37.78 26.99,37.78 29.53,35.24 | J1.2 3.65,2.06 | v32.07,30.8 32.07,32.7 29.53,35.24 | v29.53,33.97 29.53,35.24

### Text on the board
tPlace: ON | microSDHC | GND | ICSP | GND | FTDI
bPlace: 0x32 | mattkeeter.com | MJK / 06/14